# EAGLE design half-pint-turbidimeter_2.0.1 (EAGLE 7.2.0)
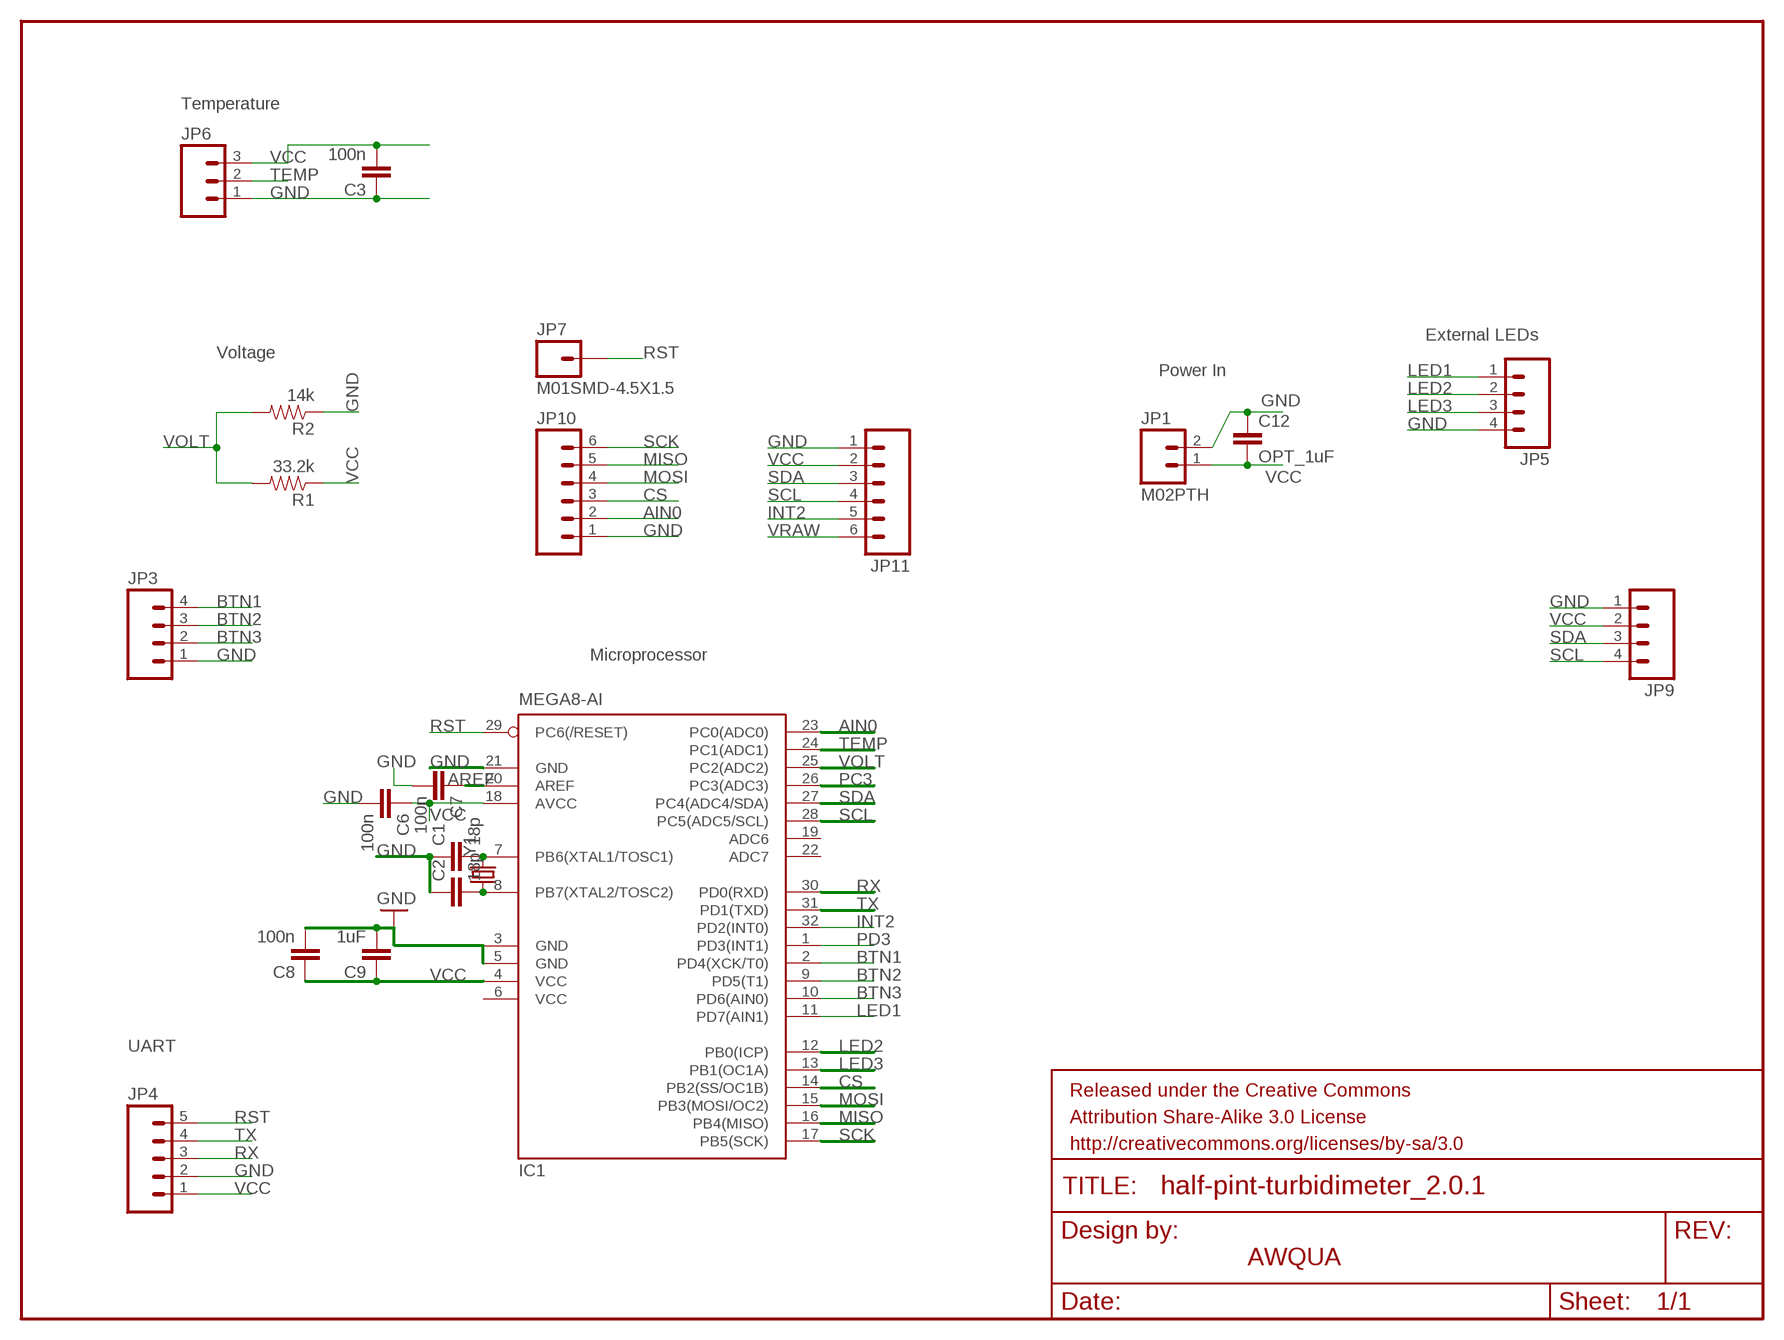
[diagram p0: schematic, sheet 1]

## Parts
C1  18p  CAP0603-CAP  [0603-CAP]
C2  18p  CAP0603-CAP  [0603-CAP]
C3  100n  CAP0603-CAP  [0603-CAP]
C6  100n  CAP0603-CAP  [0603-CAP]
C7  100n  CAP0603-CAP  [0603-CAP]
C8  100n  CAP0603-CAP  [0603-CAP]
C9  1uF  CAP0603-CAP  [0603-CAP]
C12  OPT_1uF  CAP0603-CAP  [0603-CAP]
FRAME1  FRAME-LETTER  [CREATIVE_COMMONS]
IC1  MEGA8-AI  [TQFP32-08]
JP1  M02PTH  [1X02]
JP3  M04PTH  [1X04]
JP4  M05PTH  [1X05]
JP5  M04PTH  [1X04]
JP6  M03PTH  [1X03]
JP7  M01SMD-4.5X1.5  [PAD-1.5X4.5]
JP9  M04PTH  [1X04]
JP10  M06SMD_MALE  [1X06_SMD_MALE]
JP11  M06SMD_MALE  [1X06_SMD_MALE]
R1  33.2k  RESISTOR0603  [0603-RES]
R2  14k  RESISTOR0603  [0603-RES]
Y1  CRYSTAL5X3  [CRYSTAL-SMD-5X3]

## Nets
AIN0: IC1.23(PC0(ADC0)) JP10.2
AREF: C7.1 IC1.20(AREF)
BTN1: IC1.2(PD4(XCK/T0)) JP3.4
BTN2: IC1.9(PD5(T1)) JP3.3
BTN3: IC1.10(PD6(AIN0)) JP3.2
CS: IC1.14(PB2(SS/OC1B)) JP10.3
GND: C1.1 C2.1 C3.1 C6.2 C7.2 C8.2 C9.2 C12.1 IC1.3(GND) IC1.5(GND) IC1.21(GND) JP1.2 JP3.1 JP4.2 JP5.4 JP6.1 JP9.1 JP10.1 JP11.1 R2.1
INT2: IC1.32(PD2(INT0)) JP11.5
LED1: IC1.11(PD7(AIN1)) JP5.1
LED2: IC1.12(PB0(ICP)) JP5.2
LED3: IC1.13(PB1(OC1A)) JP5.3
MISO: IC1.16(PB4(MISO)) JP10.5
MOSI: IC1.15(PB3(MOSI/OC2)) JP10.4
PC3: IC1.26(PC3(ADC3))
PD3: IC1.1(PD3(INT1))
Q1: C2.2 IC1.8(PB7(XTAL2/TOSC2)) Y1.1
Q2: C1.2 IC1.7(PB6(XTAL1/TOSC1)) Y1.3
RST: IC1.29(PC6(/RESET)) JP4.5 JP7.P$1
RX: IC1.30(PD0(RXD)) JP4.3
SCK: IC1.17(PB5(SCK)) JP10.6
SCL: IC1.28(PC5(ADC5/SCL)) JP9.4 JP11.4
SDA: IC1.27(PC4(ADC4/SDA)) JP9.3 JP11.3
TEMP: IC1.24(PC1(ADC1)) JP6.2
TX: IC1.31(PD1(TXD)) JP4.4
VCC: C3.2 C6.1 C8.1 C9.1 C12.2 IC1.4(VCC) IC1.18(AVCC) JP1.1 JP4.1 JP6.3 JP9.2 JP11.2 R1.1
VOLT: IC1.25(PC2(ADC2)) R1.2 R2.2
VRAW: JP11.6
Unconnected: IC1.19(ADC6) IC1.22(ADC7)

## Notes on the sheet
- Temperature
- External LEDs
- Voltage
- Power In
- Microprocessor
- UART
- AWQUA

## Power pins joined to a net without a drawn wire
VCC: IC1.6(VCC)

## Library data of the parts
C1-C3 C6-C9 C12 = SparkFun:CAP: Capacitor Standard 0603 ceramic capacitor, and 0.1" leaded capacitor.
FRAME1 = SparkFun-Aesthetics:FRAME-LETTER: Schematic Frame Standard 8.5x11 US Letter frame
IC1 = atmel:MEGA8: MICROCONTROLLER 8 Kbytes FLASH, 1 kbytes SRAM, 512 bytes EEPROM, USART, 6-channel 10 bit ADC, 2-channel 8 bit ADC Pin compatible with Atmega48, ATMega88, ATMega168 Source: avr.lbr; MPN: ATMEGA8-16AU; OC_FARNELL: 9171371; OC_NEWARK: 73M8863
JP1 = SparkFun-Connectors:M02: Standard 2-pin 0.1" header. Use with - straight break away headers ( PRT-00116) - right angle break away headers (PRT-00553) - swiss pins (PRT-00743) - machine pins (PRT-00117) - female headers (PRT-00115) Molex polarized connector foot print use with: PRT-08233 with associated crimp pins and housings. 2.54_SCREWTERM for use with PRT-10571. 3.5mm Screw Terminal footprints for PRT-08084 5mm Screw Terminal footprints for use with PRT-08433
JP3 JP5 JP9 = SparkFun-Connectors:M04: Header 4 Standard 4-pin 0.1" header. Use with straight break away headers (SKU : PRT-00116), right angle break away headers (PRT-00553), swiss pins (PRT-00743), machine pins (PRT-00117), and female headers (PRT-00115). Molex polarized connector foot print use with SKU : PRT-08231 with associated crimp pins and housings. 1MM SMD Version SKU: PRT-10208
JP4 = SparkFun-Connectors:M05: Header 5 Standard 5-pin 0.1" header. Use with straight break away headers (SKU : PRT-00116), right angle break away headers (PRT-00553), swiss pins (PRT-00743), machine pins (PRT-00117), and female headers (PRT-00115). Molex polarized connector foot print use with SKU : PRT-08230 with associated crimp pins and housings.
JP6 = SparkFun-Connectors:M03: Header 3 Standard 3-pin 0.1" header. Use with straight break away headers (SKU : PRT-00116), right angle break away headers (PRT-00553), swiss pins (PRT-00743), machine pins (PRT-00117), and female headers (PRT-00115). Molex polarized connector foot print use with SKU : PRT-08232 with associated crimp pins and housings.
JP7 = SparkFun-Connectors:M01: Header 1 Standard 1-pin 0.1" header. Use with straight break away headers (SKU : PRT-00116), right angle break away headers (PRT-00553), swiss pins (PRT-00743), machine pins (PRT-00117), and female headers (PRT-00115).
JP10 JP11 = SparkFun-Connectors:M06: Header 6 Standard 6-pin 0.1" header. Use with straight break away headers (SKU : PRT-00116), right angle break away headers (PRT-00553), swiss pins (PRT-00743), machine pins (PRT-00117), and female headers (PRT-00115). Molex polarized connector foot print use with SKU : PRT-08094 with associated crimp pins and housings. NOTES ON THE VARIANTS LOCK and LOCK_LONGPADS... This footprint was designed to help hold the alignment of a through-hole component (i.e. 6-pin header) while soldering it into place. You may notice that each hole has been shifted either up or down by 0.005 of an inch from it's more standard position (which is a perfectly straight line). This slight alteration caused the pins (the squares in the middle) to touch the edges of the holes. Because they are alternating, it causes a "brace" to hold the component in place. 0.005 has proven to be the perfect amount of "off-center" position when using our standard breakaway headers. Although looks a little odd when you look at the bare footprint, once you have a header in there, the alteration is very hard to notice. Also,if you push a header all the way into place, it is covered up entirely on the bottom side. This idea of altering the position of holes to aid alignment will be further integrated into the Sparkfun Library for other footprints. It can help hold any component with 3 or more connection pins.; PROD_ID: CONN-11293
R1 R2 = SparkFun-Resistors:RESISTOR: Resistor Basic schematic elements and footprints for 0603, 1206, and PTH resistors.
Y1 = SparkFun:CRYSTAL: Crystals Various standard crystals. Proven footprints. Spark Fun Electronics SKU : COM-00534

## Board
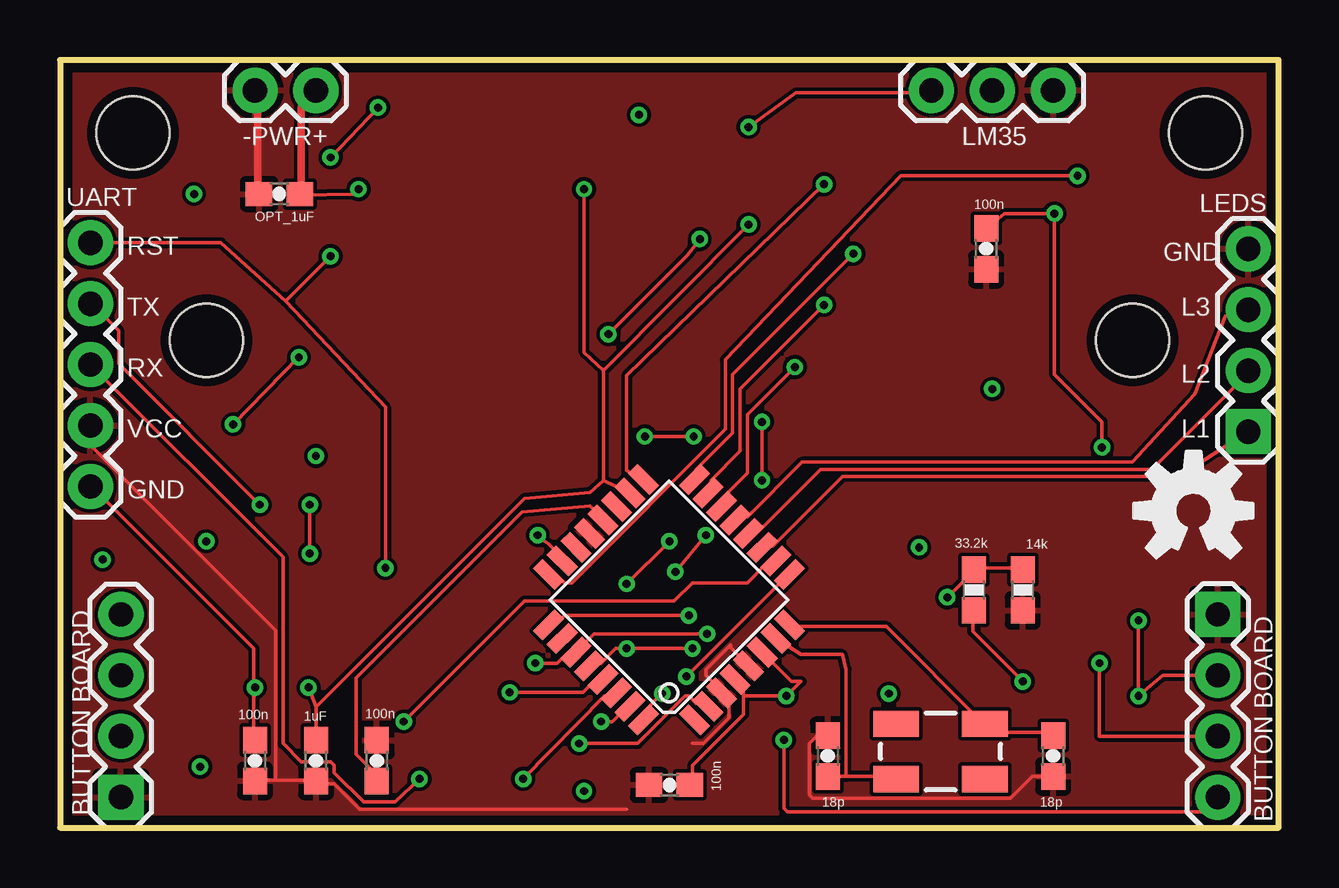
[diagram p1: board, top side]
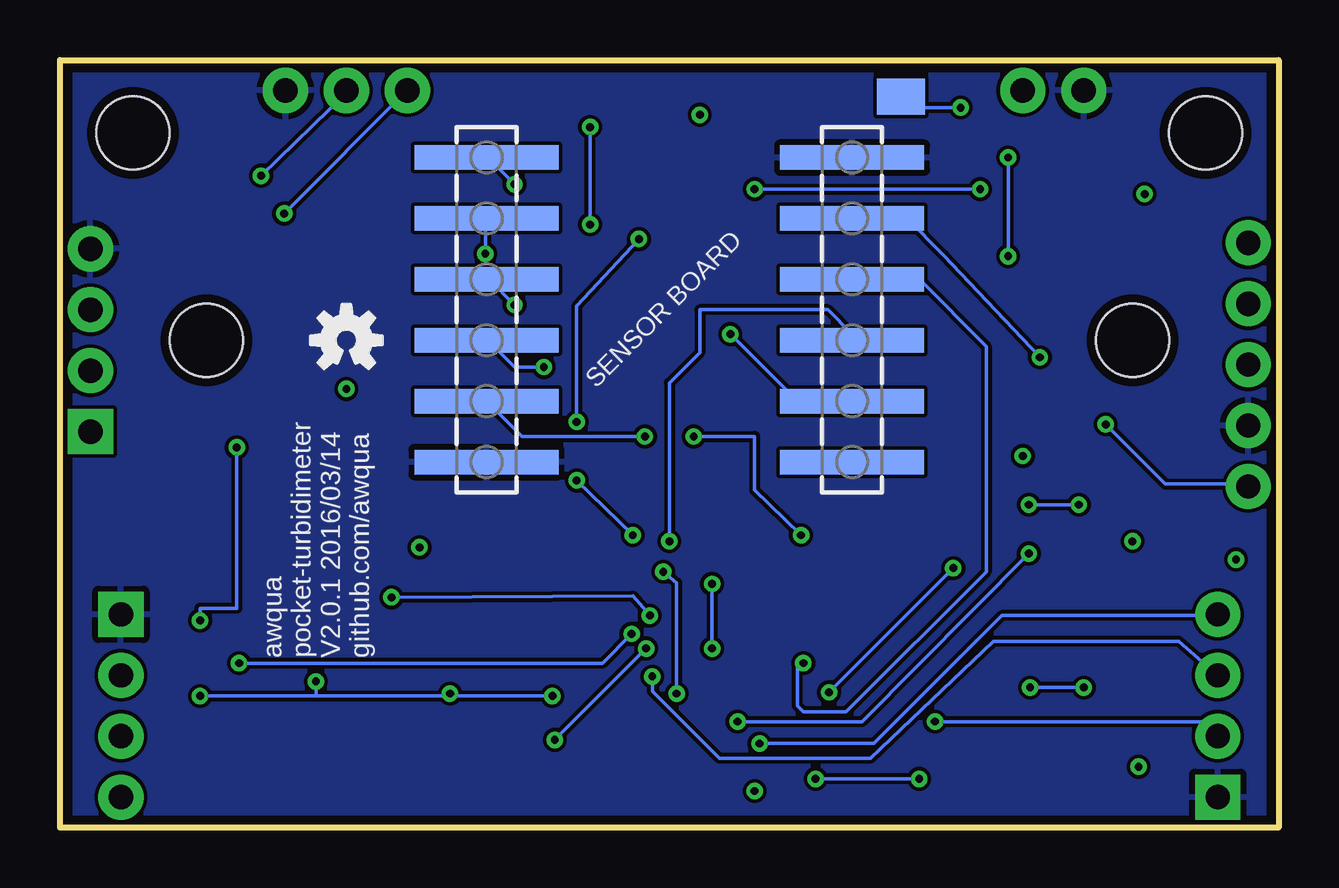
[diagram p2: board, bottom side, seen from below]

Size 50.8 x 32 mm. Coordinates in mm from the lower left corner, seen from the top.
Outline: 0,0 50.8,0 50.8,32 0,32 0,0
Copper layers (1*16): Top 0.0356mm / dielectric 1.5011mm / Bottom 0.0356mm
Design rules "default *": minimum track width 6mil, minimum drill 13mil, track to track 6mil, track to pad 6mil, pad to pad 6mil, via to via 6mil, smd to smd 6mil, copper to edge 15mil, drill to drill 6mil, minimum pad ring 7mil, minimum via ring 7mil, stop-mask expansion 4mil, vias tented up to drill 15mil, thermal gap 10mil
Holes 3.05 mm at 47.75,28.96 3.05,28.96 6.1,20.32 44.7,20.32

### Footprints (pad centres in the part's own frame; a part is rotated, then mirrored left to right if it is on the bottom)
0603-CAP = smd 1.1 x 1: 1 -0.85,0; 2 0.85,0
TQFP32-08 = smd 1.27 x 0.559: 1 -4.293,2.8; 2 -4.293,2; 3 -4.293,1.2; 4 -4.293,0.4; 5 -4.293,-0.4; 6 -4.293,-1.2; 7 -4.293,-2; 8 -4.293,-2.8; 17 4.293,-2.8; 18 4.293,-2; 19 4.293,-1.2; 20 4.293,-0.4; 21 4.293,0.4; 22 4.293,1.2; 23 4.293,2; 24 4.293,2.8 | smd 0.559 x 1.27: 9 -2.8,-4.293; 10 -2,-4.293; 11 -1.2,-4.293; 12 -0.4,-4.293; 13 0.4,-4.293; 14 1.2,-4.293; 15 2,-4.293; 16 2.8,-4.293; 25 2.8,4.293; 26 2,4.293; 27 1.2,4.293; 28 0.4,4.293; 29 -0.4,4.293; 30 -1.2,4.293; 31 -2,4.293; 32 -2.8,4.293
1X02 = drill 1.016 pad 1.88: 1 0,0; 2 2.54,0
1X04 = drill 1.016 pad 1.88 square: 1 0,0 | drill 1.016 pad 1.88: 2 2.54,0; 3 5.08,0; 4 7.62,0
1X05 = drill 1.016 pad 1.88: 1 0,0; 2 2.54,0; 3 5.08,0; 4 7.62,0; 5 10.16,0
1X03 = drill 1.016 pad 1.88: 1 0,0; 2 2.54,0; 3 5.08,0
PAD-1.5X4.5 = smd 1.5 x 2: P$1 0,0
1X06_SMD_MALE = smd 1.02 x 6: 1 0,0; 2 2.54,0; 3 5.08,0; 4 7.62,0; 5 10.16,0; 6 12.7,0
0603-RES = smd 1.1 x 1: 1 -0.85,0; 2 0.85,0
CRYSTAL-SMD-5X3 = smd 1.9 x 1.1: 1 -1.85,-1.15; 2 1.85,-1.15; 3 1.85,1.15; 4 -1.85,1.15

### Placement (x,y rotation side)
C1  32,2.98 270 top
C2  41.4,2.98 90 top
C3  38.61,24.13 90 top
C6  25.4,1.78 180 top
C7  13.21,2.79 90 top
C8  8.13,2.79 270 top
C9  10.67,2.79 270 top
C12  9.14,26.42 0 top
FRAME1  18.92,-12.19 0 top  (outside the outline)
IC1  25.39,9.5 135 top
JP1  10.67,30.73 180 top
JP3  2.54,1.27 90 top
JP4  1.27,14.22 90 top
JP5  49.53,16.51 90 top
JP6  41.4,30.73 180 top
JP7  15.75,30.48 270 bottom
JP9  48.26,8.89 270 top
JP10  33.02,15.24 90 bottom
JP11  17.78,27.94 270 bottom
R1  38.1,9.91 90 top
R2  40.13,9.91 90 top
U$4  [OSHW-LOGO-M]  47.24,13.21 0 top
U$5  [OSHW-LOGO-S]  38.86,20.32 0 bottom
Y1  36.7,3.17 180 top

### Tracks (layer width: path | path; a pad name or v marks a point on that pad's centre or on a via)
AIN0  (via drill 0.33)
  Top 0.152: v19.91,12.19 19.91,12.14 20.37,11.84 20.83,11.38 20.88,11.12 IC1.23 | v26.42,16.31 v24.38,16.31
  Bottom 0.152: v26.42,16.31 31.55,16.31 JP10.2 | v24.38,16.31 21.84,16.31 21.84,14.07 20.57,12.85 v19.91,12.19
AREF
  Top 0.152: C7.1 13.11,1.98 13.11,2.29 12.34,3.05 12.34,6.25 19.25,13.16 22.1,13.41 22.55,12.95 IC1.20
BTN1  (via drill 0.33)
  Top 0.152: v21.64,3.5 24.08,3.5 26.06,5.49 26.21,5.49 26.52,5.18 26.98,5.18 IC1.2
  Bottom 0.152: v21.64,3.5 16.87,3.5 11.53,8.84 3.4,8.84 JP3.4
BTN2  (via drill 0.33)
  Top 0.152: v26.11,6.3 30.33,10.52 IC1.9
  Bottom 0.152: v26.11,6.3 26.11,5.69 23.32,2.9 17.02,2.9 11.89,7.77 4.17,7.77 JP3.3
BTN3  (via drill 0.33)
  Top 0.152: v14.33,4.42 19.36,9.45 25.6,9.45 26.36,10.21 28.65,10.21 29.41,10.97 29.72,10.97 IC1.10
  Bottom 0.152: v14.33,4.42 3.25,4.42 2.9,4.06 JP3.2
CS  (via drill 0.33)
  Top 0.152: v30.63,19.2 28.65,17.22 28.65,14.78 27.58,13.72 27.58,13.41 IC1.14
  Bottom 0.152: v30.63,19.2 31.85,19.2 32.92,20.27 JP10.3
GND
  Top 0.152: 8.23,26.52 C12.1 | 8.23,30.63 JP1.2 | 8.99,1.98 10.67,1.98 C9.2 10.67,1.83 11.43,1.83 12.5,0.76 23.62,0.76 | 8.99,1.98 8.23,1.98 C8.2 | 40.18,8.99 R2.1 | 31.7,3.96 32,3.96 C1.1 31.7,3.96 | 26.36,3.5 26.82,3.5 27.89,4.57 27.89,5.18 27.58,5.49 IC1.3 27.57,5.7 26.92,6.35 26.92,6.6 27.94,7.62 27.94,7.52 IC1.5 | 24.69,1.83 C6.2 24.54,1.68 | 31.7,3.96 31.24,3.5 31.24,1.37 31.39,1.22 39.62,1.22 40.54,2.13 41.3,2.13 C2.1 | 8.99,1.98 8.99,8.23 1.37,15.85 1.37,16.76 JP4.2
  Top 0.305: 8.23,30.63 8.23,26.52
  pour Top: -3.56,35.31 57.66,37.34 57.4,-1.02 -3.05,-1.02
  pour Bottom: -2.29,33.27 53.85,33.27 54.61,-2.79 -1.78,-3.05
INT2  (via drill 0.33)
  Top 0.152: v25.09,5.59 24.38,4.88 24.38,4.57 IC1.32 | v26.92,12.19 v25.65,10.67 | v29.26,16.92 v29.26,14.48 | v26.67,24.54 26.16,23.88 v22.86,20.57
  Bottom 0.152: v25.09,5.59 25.09,10.21 v25.65,10.67 | v29.26,14.48 v26.92,12.19 | v29.26,16.92 29.26,21.74 v26.67,24.54 | JP11.5 20.07,17.78 v22.86,20.57
LED1
  Top 0.152: JP5.1 46.63,14.63 32.61,14.63 29.72,11.73 29.41,11.73 IC1.11
LED2
  Top 0.152: IC1.12 28.8,12.34 29.11,12.34 31.7,14.94 45.52,14.94 49.53,18.95 JP5.2
LED3
  Top 0.152: IC1.13 28.19,12.95 28.65,12.95 30.94,15.24 44.7,15.24 47.3,18.09 48.56,21.34 49.53,21.54 JP5.3
MISO  (via drill 0.33)
  Top 0.152: v33.07,23.93 28.04,18.9 28.04,16.46 26.52,14.94 26.52,14.63 IC1.16
  Bottom 0.152: v33.07,23.93 33.07,25.3 JP10.5
MOSI  (via drill 0.33)
  Top 0.152: v31.85,21.79 28.35,18.29 28.35,15.7 27.13,14.48 27.13,14.02 IC1.15
  Bottom 0.152: v31.85,21.79 32.92,22.86 JP10.4
N$1  (via drill 0.33)
  other vias: 38.86,18.29
N$2  (via drill 0.33)
  other vias: 35.81,11.68
N$3  (via drill 0.33)
  other vias: 21.84,1.52
N$4  (via drill 0.33)
  other vias: 5.84,2.54
N$5  (via drill 0.33)
  other vias: 6.1,11.94
N$6  (via drill 0.33)
  other vias: 1.78,11.18
N$7  (via drill 0.33)
  other vias: 5.59,26.42
N$8  (via drill 0.33)
  other vias: 24.13,29.72
N$9  (via drill 0.33)
  other vias: 10.67,15.49
Q1
  Top 0.152: C2.2 41.3,3.96 38.86,3.96 38.56,4.27 Y1.1 38.41,4.42 34.44,8.38 30.48,8.38 IC1.8
Q2
  Top 0.152: 32.77,2.13 34.75,2.13 Y1.3 | 32.77,2.13 C1.2 | 32.77,2.13 32.77,6.6 32.61,7.21 30.89,7.21 IC1.7
RST  (via drill 0.33)
  Top 0.152: v18.75,5.64 21.79,5.64 22.25,6.1 22.55,6.1 IC1.29 | v13.56,10.82 13.56,17.53 9.4,21.95 | 9.4,21.95 6.71,24.38 JP4.5 | v11.28,27.94 v13.26,30.02 | 9.4,21.95 v11.28,23.82
  Bottom 0.152: v13.56,10.82 v18.75,5.64 | v11.28,23.82 v11.28,27.94 | v13.26,30.02 15.7,30.02 15.7,30.48 JP7.P$1
RX  (via drill 0.33)
  Top 0.152: v19.3,2.03 22.71,5.49 23.16,5.49 IC1.30 | v14.99,2.03 13.97,1.07 12.65,1.07 11.43,2.29 11.43,2.59 11.28,2.74 10.06,2.74 9.3,3.5 9.3,11.28 JP4.3
  Bottom 0.152: v14.99,2.03 v19.3,2.03
SCK  (via drill 0.33)
  Top 0.152: v31.85,26.82 23.62,18.85 23.62,14.88 IC1.17
  Bottom 0.152: v31.85,26.82 32.92,27.89 JP10.6
SCL  (via drill 0.33)
  Top 0.152: v26.36,7.47 v23.62,7.47 23.16,7.47 22.55,6.86 22.1,6.86 IC1.28 | v30.18,3.66 30.18,0.81 30.33,0.66 47.65,0.66 JP9.4 | v25.4,11.94 v23.62,10.16
  Bottom 0.152: v30.18,3.66 v26.36,7.47 | JP11.4 17.78,20.57 18.8,21.59 24.13,21.59 24.13,19.81 25.4,18.54 v25.4,11.94 | v23.62,10.16 v23.62,7.47
SDA  (via drill 0.33)
  Top 0.152: v19.81,6.86 20.73,6.86 21.18,7.32 21.49,7.32 IC1.27 21.64,7.47 22.25,8.08 v26.98,8.08 | JP9.3 43.33,3.81 v43.33,6.86
  Bottom 0.152: v43.33,6.86 28.19,6.86 v26.98,8.08 | JP11.3 14.99,22.86 12.19,20.07 12.19,10.67 18.03,4.83 19.81,4.83 20.07,5.08 20.07,6.86 v19.81,6.86
TEMP  (via drill 0.33)
  Top 0.152: v42.42,27.18 35.05,27.18 27.74,19.51 27.74,16.61 21.34,10.21 21.03,10.21 20.73,10.52 20.42,10.52 IC1.24
  Bottom 0.152: v42.42,27.18 38.86,30.63 JP6.2
TX  (via drill 0.33)
  Top 0.152: v22.55,4.42 23.01,4.42 23.62,5.03 IC1.31 | v10.41,13.46 v10.41,11.43 | v8.33,13.46 2.44,19.36 2.44,20.73 1.37,21.79 JP4.4
  Bottom 0.152: v22.55,4.42 17.37,4.42 v10.41,11.43 | v8.33,13.46 v10.41,13.46
VCC  (via drill 0.33)
  Top 0.152: 8.08,5.33 8.08,7.47 1.37,14.17 JP4.1 | 8.08,5.33 8.08,3.66 C8.1 | 10.06,26.52 C12.2 10.06,26.36 12.19,26.42 v12.45,26.62 | 10.67,30.63 JP1.1 | v9.96,19.61 v7.21,16.82 | 28.5,5.49 28.5,5.79 28.19,6.1 IC1.4 | 28.5,5.49 28.5,4.72 26.36,2.59 26.36,1.83 C6.1 | 38.2,9.14 R1.1 38.05,8.99 | 28.96,7.77 29.26,7.47 IC1.6 30.27,6.3 30.48,6.1 30.89,6.1 v30.28,5.49 28.5,5.49 | 38.05,8.99 38.2,8.89 | JP9.2 45.97,6.35 v44.96,5.49 v44.96,8.64 | C3.2 39.37,25.6 v41.45,25.6 41.45,18.9 43.43,16.92 v43.43,15.85 | 10.67,5.03 C9.1 | 10.67,5.03 19.36,13.72 22.1,13.97 22.66,14.48 | 22.66,14.48 23.62,14.02 IC1.18 | 22.66,19.05 v28.7,25.15 | v28.7,29.21 30.68,30.63 36.27,30.63 JP6.3 | 22.66,14.48 22.66,19.05 | 22.66,19.05 21.84,19.81 v21.84,26.62 | v10.36,5.84 10.67,5.03 | v8.13,5.84 8.08,5.33 | 38.05,8.99 38.05,8.18 v40.13,6.1
  Top 0.305: 10.06,26.52 10.06,30.02 10.67,30.63
  Bottom 0.152: v9.96,19.61 13.97,23.88 15.49,25.4 16.73,25.4 16.76,25.43 | 15.9,25.45 16.76,25.43 | 16.76,25.43 JP11.2 | v7.21,16.82 4.72,14.33 1.37,14.33 JP4.1 | v44.96,5.49 40.13,5.49 | 40.13,5.49 34.54,5.49 | 34.54,5.49 v30.28,5.49 | JP6.3 v41.45,25.6 | v28.7,25.15 v28.7,29.21 | v43.43,15.85 43.43,9.14 44.96,9.14 v44.96,8.64 | v21.84,26.62 v12.45,26.62 | v8.13,5.84 v10.36,5.84 | v34.54,5.59 34.54,5.49 | v40.13,6.1 40.13,5.49
VOLT  (via drill 0.33)
  Top 0.152: R2.2 40.03,10.82 38.2,10.82 R1.2 38.05,10.67 v36.98,9.6 | v26.21,8.84 21.03,8.84 20.73,8.53 20.42,8.53 IC1.25
  Bottom 0.152: v36.98,9.6 26.92,9.65 v26.21,8.84

### Text on the board
bPlace: awqua / pocket-turbidimeter / V2.0.1 2016/03/14 / github.com/awqua
tNames: -PWR+ | LM35 | UART | LEDS | RST | GND | TX | L3 | RX | L2 | VCC | L1 | GND | BUTTON BOARD | BUTTON BOARD
bNames: SENSOR BOARD